# EAGLE design CORS_Rear_Panel (EAGLE 9.6.2)
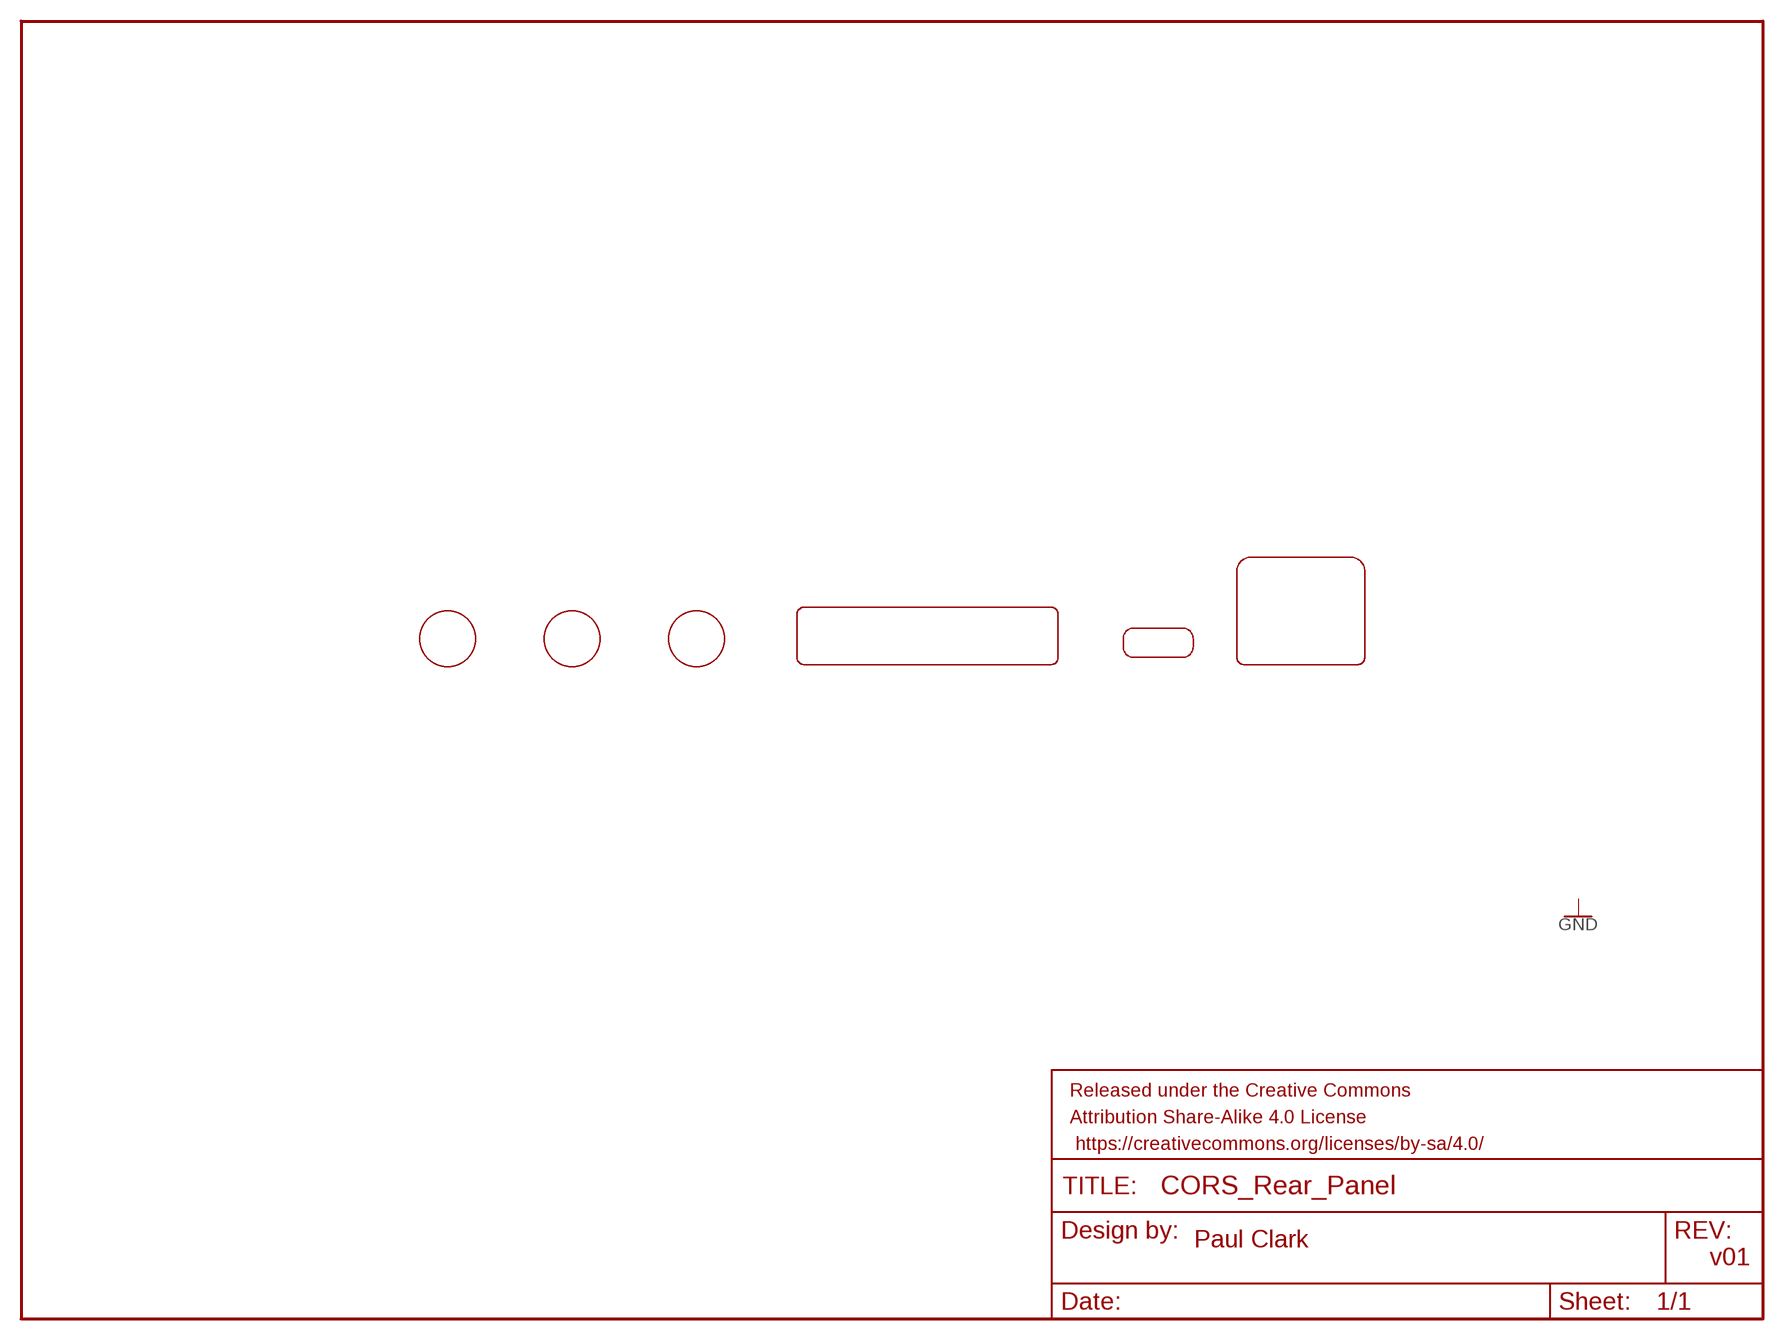
[diagram p0: schematic, sheet 1]

## Parts
ESP32_USB  USB-C  [USB-C]
FRAME1  FRAME-LETTER  [CREATIVE_COMMONS]
U$8  3.5MM_CONNECTOR  [3.5MM_CONNECTOR]
U$13  SMA  [SMA]
U$14  SMA  [SMA]
U$15  SMA  [SMA]
U$25  ETHERNET  [ETHERNET]

## Notes on the sheet
- Paul Clark
- v01

## Library data of the parts
ESP32_USB = CORS_Panels:USB-C
FRAME1 = SparkFun-Aesthetics:FRAME-LETTER: Schematic Frame - Letter Standard 8.5x11 US Letter frame
U$8 = CORS_Panels:3.5MM_CONNECTOR
U$13-U$15 = CORS_Panels:SMA
U$25 = CORS_Panels:ETHERNET

## Board
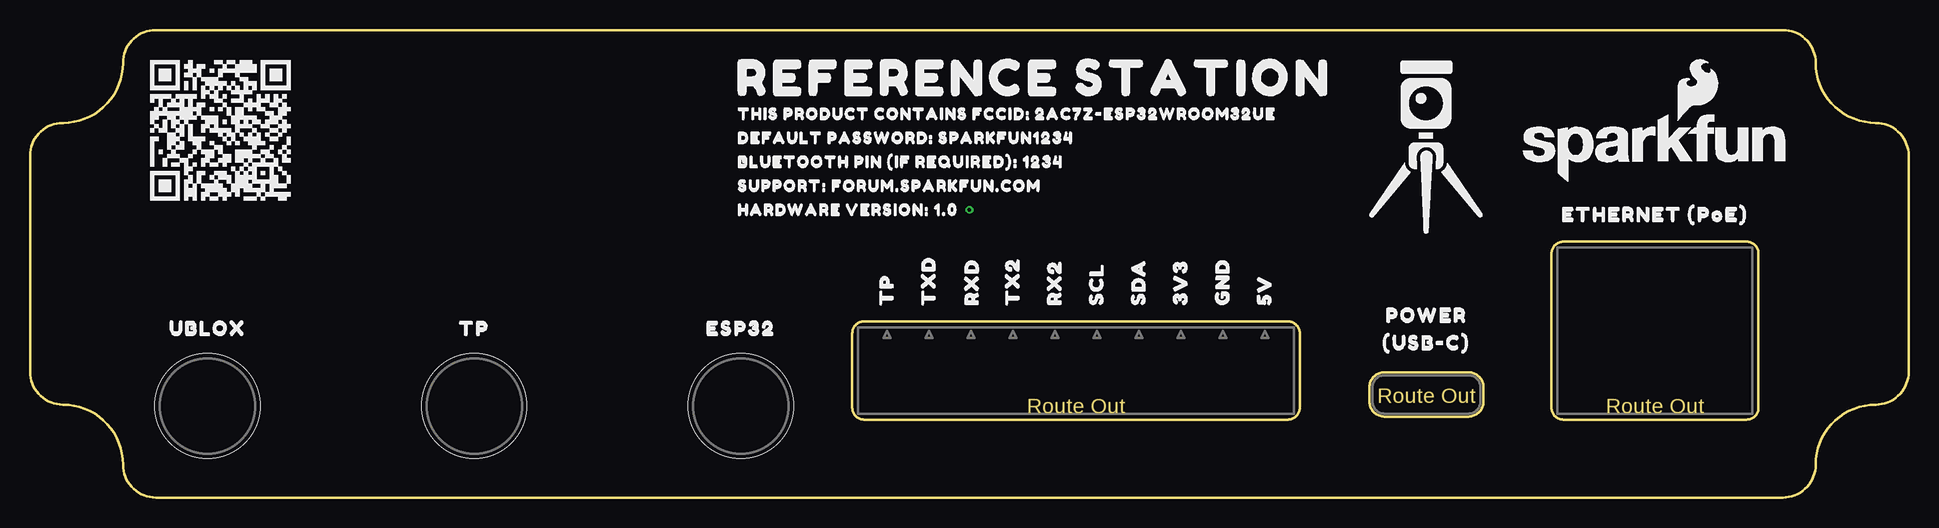
[diagram p1: board, top side]

Size 156.6 x 39 mm. Coordinates in mm from the lower left corner, seen from the top.
Outline: 0,28.5 0,10.5 arc90 2.75,7.75 arc-90 7.75,2.75 arc90 10.5,0 146.1,0 arc90 148.85,2.75 arc-90 153.85,7.75 arc90 156.6,10.5 156.6,28.5 arc90 153.85,31.25 arc-90 148.85,36.25 arc90 146.1,39 10.5,39 arc90 7.75,36.25 arc-90 2.75,31.25 arc90 0,28.5
Copper layers (1*16): Top 0.035mm / dielectric 1.5mm / Bottom 0.035mm
Design rules "SparkFun-2-Layer-General-JLCPCB": minimum track width 7mil, minimum drill 0.3mm, track to track 7mil, track to pad 7mil, pad to pad 7mil, via to via 7mil, smd to smd 7mil, copper to edge 7mil, drill to drill 7mil, minimum pad ring 7mil, minimum via ring 7mil, stop-mask expansion 3mil, vias tented up to drill 25mil, thermal gap 10mil

### Footprints (pad centres in the part's own frame; a part is rotated, then mirrored left to right if it is on the bottom)
SMA = hole 8.75: 0,0.635

### Placement (x,y rotation side)
ESP32_USB  116.4,7 0 top
FRAME1  59.25,-17.13 0 top  (outside the outline)
LOGO1  SFE_LOGO_NAME_FLAME.2_INCH  [SFE_LOGO_NAME_FLAME_.2]  135.45,29.18 0 top
U$1  [REFERENCE_STATION0]  83.7,35 0 top
U$2  [THIS_PRODUCT_CONTAINS_FCCID#_2AC7Z#ESP32WROOM32UE0]  58.3,32 0 top
U$3  [BLUETOOTH_PIN_#IF_REQUIRED##_12340]  58.3,28 0 top
U$4  [SUPPORT#_FORUM#SPARKFUN#COM0]  58.3,26 0 top
U$5  [TP0]  71.4,15.2 90 top
U$6  [TXD1]  74.9,15.2 90 top
U$7  [HARDWARE_VERSION#_1#00]  58.3,24 0 top
U$8  87.19,7 0 top
U$9  [RXD2]  78.5,15.2 90 top
U$10  [TX23]  81.9,15.2 90 top
U$11  [RX224]  85.4,15.2 90 top
U$12  [SCL225]  88.9,15.2 90 top
U$13  14.8,7 0 top
U$14  37.02,7 0 top
U$15  59.25,7 0 top
U$16  [SDA226]  92.4,15.2 90 top
U$17  [3V3227]  95.9,15.2 90 top
U$18  [GND227]  99.4,15.2 90 top
U$19  [5V228]  102.9,15.2 90 top
U$20  [DEFAULT_PASSWORD#_SPARKFUN12340]  58.3,30 0 top
U$23  [UBLOX326]  14.8,14.1 0 top
U$25  135.45,7 0 top
U$28  [TP327]  37.02,14.1 0 top
U$29  [ESP324]  59.25,14.1 0 top
U$40  [POWER22335]  116.4,15.2 0 top
U$41  [_#USB#C#_22336]  116.4,12.9 0 top
U$42  [_ETHERNET_#POE#_22337]  135.45,23.6 0 top

### Tracks (layer width: path | path; a pad name or v marks a point on that pad's centre or on a via)
GND  (via drill 0.3)
  other vias: 78.3,24

### Text on the board
tDocu: Paul Clark